# Altium project Ultrascale.PrjPcb (part 5 of 9)

## Sheet PS_GTR.SchDoc
size A3
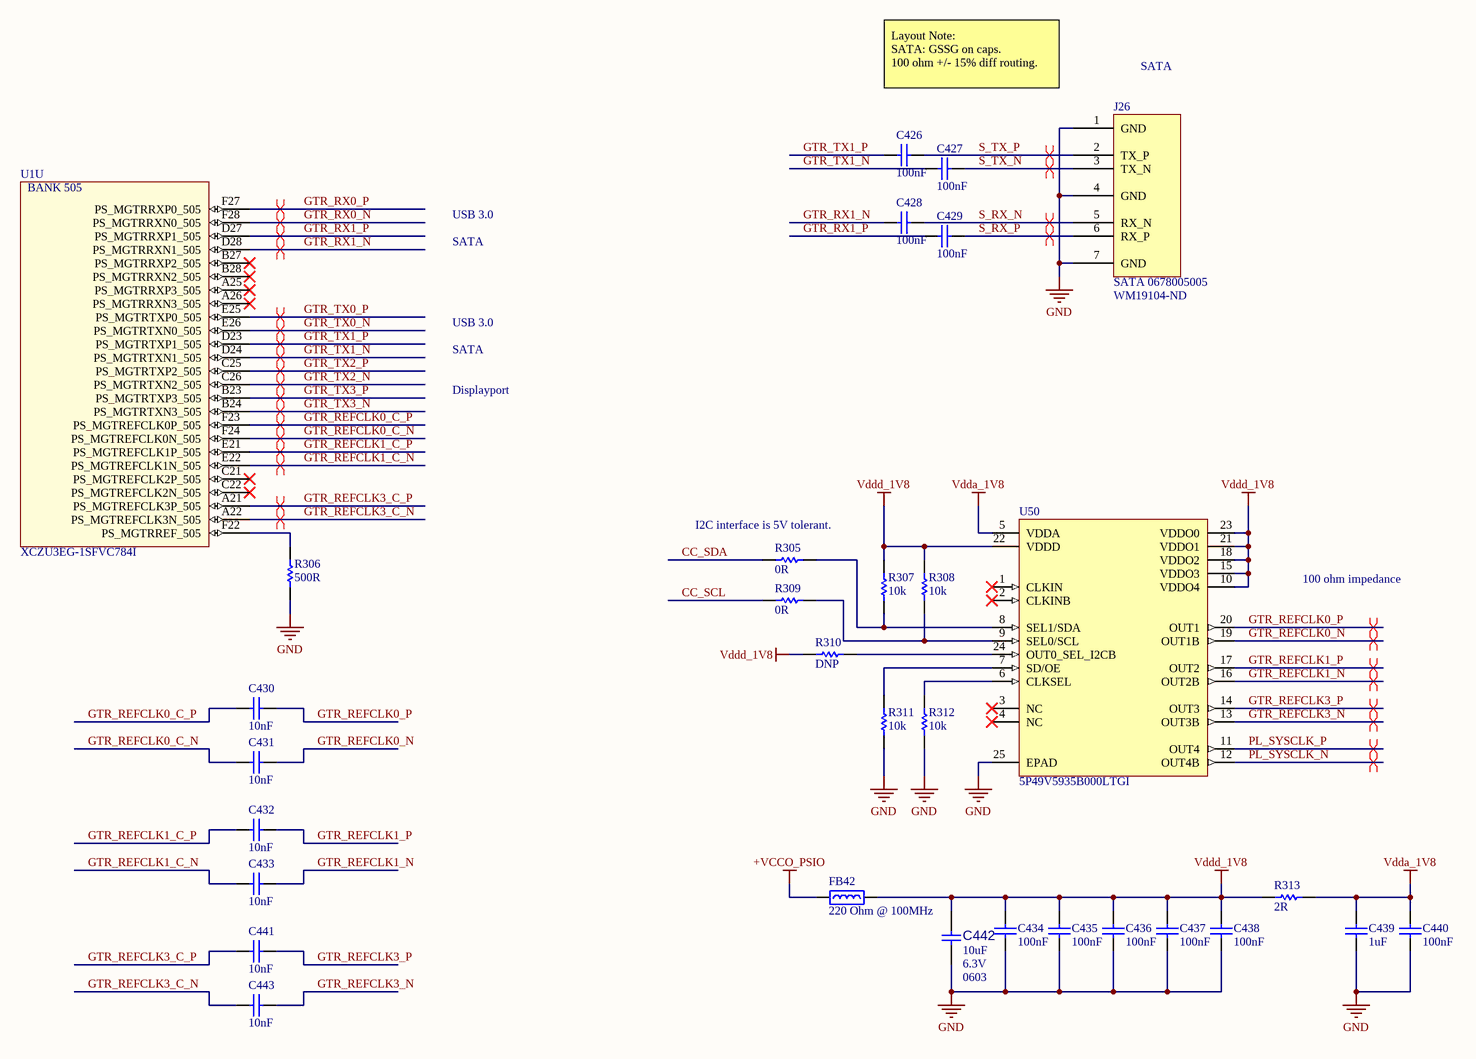
[diagram p13: PS_GTR.SchDoc]

### Parts
C426  100nF  [CAPC1005L_0402]
C427  100nF  [CAPC1005L_0402]
C428  100nF  [CAPC1005L_0402]
C429  100nF  [CAPC1005L_0402]
C430  10nF  [CAPC1005L_0402]
C431  10nF  [CAPC1005L_0402]
C432  10nF  [CAPC1005L_0402]
C433  10nF  [CAPC1005L_0402]
C434  100nF  [CAPC1005L_0402]
C435  100nF  [CAPC1005L_0402]
C436  100nF  [CAPC1005L_0402]
C437  100nF  [CAPC1005L_0402]
C438  100nF  [CAPC1005L_0402]
C439  1uF  [CAPC1005L_0402]
C440  100nF  [CAPC1005L_0402]
C441  10nF  [CAPC1005L_0402]
C442  value 10uF  Voltage: 6.3V  Package: 0603  [CAP_C_0603]  (hidden comment: Capacitor NP)
C443  10nF  [CAPC1005L_0402]
FB42  Impedance @ Frequency: 220 Ohm @ 100MHz  [INDC1608N_0603]  (hidden comment: BEAD0603_220_2A5_40M)
J26  SATA 0678005005  Supplier Part Number 1: WM19104-ND  [SATA HEADER]
R305  value 0R  [RESC1005L_0402]  (hidden comment: RES0402_0R_0W1)
R306  value 500R  [RESC1005L_0402]  (hidden comment: RES0402_500R_0W05_01T)
R307  value 10k  [RESC1005L_0402]  (hidden comment: RES0402_10K_0W1_05T)
R308  value 10k  [RESC1005L_0402]  (hidden comment: RES0402_10K_0W1_05T)
R309  value 0R  [RESC1005L_0402]  (hidden comment: RES0402_0R_0W1)
R310  value DNP  [RESC1005L_0402]  (hidden comment: RES0402)
R311  value 10k  [RESC1005L_0402]  (hidden comment: RES0402_10K_0W1_05T)
R312  value 10k  [RESC1005L_0402]  (hidden comment: RES0402_10K_0W1_05T)
R313  value 2R  [RESC1005L_0402]  (hidden comment: RES0402_2R_0W1_1T)
U1  XCZU3EG-1SFVC784I  [BGA784x28]  (part U of 22)
U50  5P49V5935B000LTGI  [LGA24_5P49V5935B000LTGI]

### Nets
+VCCO_PSIO: FB42.1  [project net +VCCAUX]
GND: C434.1 C435.1 C436.1 C437.1 C438.1 C439.1 C440.1 C442.1 J26.1(GND) J26.4(GND) J26.7(GND) R306.1 R311.1 R312.1 U50.25(EPAD)
Vdda_1V8: C439.2 C440.2 R313.2 U50.5(VDDA)
Vddd_1V8: C434.2 C435.2 C436.2 C437.2 C438.2 C442.2 FB42.2 R307.2 R308.2 R310.1 R313.1 U50.10(VDDO4) U50.15(VDDO3) U50.18(VDDO2) U50.21(VDDO1) U50.22(VDDD) U50.23(VDDO0)
CC_SCL: R309.1
CC_SDA: R305.1
GTR_REFCLK0_C_N: C431.1 U1.F24(PS_MGTREFCLK0N_505)
GTR_REFCLK0_C_P: C430.1 U1.F23(PS_MGTREFCLK0P_505)
GTR_REFCLK0_N: C431.2 U50.19(OUT1B)
GTR_REFCLK0_P: C430.2 U50.20(OUT1)
GTR_REFCLK1_C_N: C433.1 U1.E22(PS_MGTREFCLK1N_505)
GTR_REFCLK1_C_P: C432.1 U1.E21(PS_MGTREFCLK1P_505)
GTR_REFCLK1_N: C433.2 U50.16(OUT2B)
GTR_REFCLK1_P: C432.2 U50.17(OUT2)
GTR_REFCLK3_C_N: C443.1 U1.A22(PS_MGTREFCLK3N_505)
GTR_REFCLK3_C_P: C441.1 U1.A21(PS_MGTREFCLK3P_505)
GTR_REFCLK3_N: C443.2 U50.13(OUT3B)
GTR_REFCLK3_P: C441.2 U50.14(OUT3)
GTR_RX0_N: U1.F28(PS_MGTRRXN0_505)
GTR_RX0_P: U1.F27(PS_MGTRRXP0_505)
GTR_RX1_N: C428.1 U1.D28(PS_MGTRRXN1_505)
GTR_RX1_P: C429.1 U1.D27(PS_MGTRRXP1_505)
GTR_TX0_N: U1.E26(PS_MGTRTXN0_505)
GTR_TX0_P: U1.E25(PS_MGTRTXP0_505)
GTR_TX1_N: C427.1 U1.D24(PS_MGTRTXN1_505)
GTR_TX1_P: C426.1 U1.D23(PS_MGTRTXP1_505)
GTR_TX2_N: U1.C26(PS_MGTRTXN2_505)
GTR_TX2_P: U1.C25(PS_MGTRTXP2_505)
GTR_TX3_N: U1.B24(PS_MGTRTXN3_505)
GTR_TX3_P: U1.B23(PS_MGTRTXP3_505)
PL_SYSCLK_N: U50.12(OUT4B)
PL_SYSCLK_P: U50.11(OUT4)
S_RX_N: C428.2 J26.5(RX_N)
S_RX_P: C429.2 J26.6(RX_P)
S_TX_N: C427.2 J26.3(TX_N)
S_TX_P: C426.2 J26.2(TX_P)
NetR305_2: R305.2 R307.1 U50.8(SEL1/SDA)
NetR306_2: R306.2 U1.F22(PS_MGTRREF_505)
NetR308_1: R308.1 R309.2 U50.9(SEL0/SCL)
NetR310_2: R310.2 U50.24(OUT0_SEL_I2CB)
NetR311_2: R311.2 U50.7(SD/OE)
NetR312_2: R312.2 U50.6(CLKSEL)

Not connected (* = marked no-connect by the designer): U1 A25(PS_MGTRRXP3_505)* A26(PS_MGTRRXN3_505)* B27(PS_MGTRRXP2_505)* B28(PS_MGTRRXN2_505)* C21(PS_MGTREFCLK2P_505)* C22(PS_MGTREFCLK2N_505)*; U50 1(CLKIN)* 2(CLKINB)* 3(NC)* 4(NC)*

### Layout directives
differential pair: GTR_REFCLK0_C_N, GTR_REFCLK0_C_P, GTR_REFCLK0_N, GTR_REFCLK0_P, GTR_REFCLK1_C_N, GTR_REFCLK1_C_P, GTR_REFCLK1_N, GTR_REFCLK1_P, GTR_REFCLK3_C_N, GTR_REFCLK3_C_P, GTR_REFCLK3_N, GTR_REFCLK3_P, GTR_RX0_N, GTR_RX0_P, GTR_RX1_N, GTR_RX1_P, GTR_TX0_N, GTR_TX0_P, GTR_TX1_N, GTR_TX1_P, GTR_TX2_N, GTR_TX2_P, GTR_TX3_N, GTR_TX3_P, PL_SYSCLK_N, PL_SYSCLK_P, S_RX_N, S_RX_P, S_TX_N, S_TX_P

### Notes on the sheet
- Layout Note:
  SATA: GSSG on caps.
  100 ohm +/- 15% diff routing.
- SATA
- USB 3.0
- Displayport
- I2C interface is 5V tolerant.
- 100 ohm impedance
- (in symbol XCZU3EG-1SFVC784I, part U) BANK 505

### Library data of the parts
C426-C429 C434-C438 C440 = CAPCER0402X7R100N25V_10T: CAP CER 0.1UF 25V X7R 0402; Manufacturer 1: Murata Electronics North America; Manufacturer Part Number 1: GRM155R71E104KE14D; Tolerance: 10%; Package: 0402; ComponentLink1Description: Datasheet; Value: 100nF; Voltage: 25V; Temperature Coefficient: X7R; Supplier 1: Digi-Key; Supplier Part Number 1: 490-10698-1-ND; Operating Temperature: -55°C ~ 125°C
C430-C433 C441 C443 = CAPCER0402X7R10N50V_10T: CAP CER 10000PF (10NF) 50V X7R 0402; Manufacturer 1: Murata Electronics North America; Manufacturer Part Number 1: GRM155R71H103KA88D; Tolerance: 10%; Package: 0402; ComponentLink1Description: Datasheet; Value: 10nF; Voltage: 50V; Temperature Coefficient: X7R; Supplier 1: Digi-Key; Supplier Part Number 1: 490-4516-1-ND; Operating Temperature: -55°C ~ 125°C
C439 = CAPCER0402X5R1U16V_20T: CAP CER 1UF 16V X5R 0402; Manufacturer 1: Murata Electronics North America; Manufacturer Part Number 1: GRM155R61C105ME01D; Tolerance: 20%; Package: 0402; ComponentLink1Description: Datasheet; Value: 1uF; Voltage: 16V; Temperature Coefficient: X5R; Supplier 1: Digi-Key; Supplier Part Number 1: 490-10454-1-ND; Operating Temperature: -55°C ~ 85°C
C442 = CAP0533: Capacitor; Manufacturer 1: AVX; Manufacturer Part Number 1: 06036D106MAT2A; Description_: CAP CER 10uF 6.3V 20% X5R SMD 0603; Dev Tools Status: Production; Tolerance: 20%; Temperature Coeffcient: X5R; Type: Ceramic; Populated: Yes; MCHP-ID: CAP0533; Revision: 1; Status: MCL Design; ComponentLink1URL: https://chn-vm-apps.microchip.com/mchprepo/parts/Datasheets/smccp.pdf; ComponentLink1Description: Datasheet; Operating Temperature: -55C to +85C; Category: Capacitor; Manufacturer 2: KEMET; Manufacturer Part Number 2: C0603C106M9PACTU; Manufacturer 3: Murata; Manufacturer Part Number 3: GRM188R60J106ME47D; Manufacturer 4: TDK Corporation; Manufacturer Part Number 4: C1608X5R0J106M080AB; Manufacturer 5: TDK Corporation; Manufacturer Part Number 5: C1608X5R0J106M; Supplier 1: Digi-Key; Supplier Part Number 1: 478-5318-2-ND; Supplier 2: Digi-Key; Supplier Part Number 2: 399-5504-1-ND; Supplier 3: Digi-Key; Supplier Part Number 3: 490-3896-2-ND; Supplier 4: Digi-Key; Supplier Part Number 4: 445-4112-1-ND; Quantity Override: 1
FB42 = BEAD0603_220_2A5_40M: FERRITE BEAD 220 OHM 0603 1LN; Manufacturer 1: Murata Electronics North America; Manufacturer Part Number 1: BLM18SG221TN1D; Current Rating (Max): 2.5A; DC Resistance (DCR) (Max): 40 mohm; Package: 0603; ComponentLink1Description: Datasheet; ComponentLink1URL: C:\Users\Public\Documents\Altium\AD16\Library\PDF\ENFA0003.pdf; Supplier 1: Digi-Key; Supplier Part Number 1: 490-5225-1-ND; Operating Temperature: -55°C ~ 125°C
J26 = SATA 0678005005: CONN HEADER 7POS VERT SMD 15GOLD; Manufacturer: Molex, LLC; Connector Style: Header, Shrouded; Number of Positions: 7; Digi-Key Part Number: WM19104-ND; Manufacturer Part Number: 0678005005; Series: 67800; Part Status: Active; Connector Type: SATA; Mounting Type: Surface Mount; Termination: Solder; Features: Board Guide; Contact Finish: Gold; Contact Finish Thickness: 15µin (0.38µm); Supplier 1: Digi-Key
R305 R309 = RES0402_0R_0W1: RES SMD 0 OHM JUMPER 1/10W 0402; Manufacturer 1: Panasonic Electronic Components; Manufacturer Part Number 1: ERJ-2GE0R00X; Package: 0402; ComponentLink1Description: Datasheet; Power: 1/10W; Tolerance: -; Supplier 1: Digi-Key; Supplier Part Number 1: P0.0JCT-ND
R306 = RES0402_500R_0W05_01T: RES SMD 500 OHM 0.1% 1/20W 0402; Manufacturer 1: Vishay Dale; Manufacturer Part Number 1: PNM0402E5000BST1; Power: 1/10W; Package: 0402; ComponentLink1Description: Datasheet; Tolerance: 0.1%; Supplier 1: Digi-Key; Supplier Part Number 1: 541-1905-1-ND
R307 R308 R311 R312 = RES0402_10K_0W1_05T: RES SMD 10K OHM 0.5% 1/16W 0402; Manufacturer 1: Panasonic Electronic Components; Manufacturer Part Number 1: ERJ-2RHD1002X; Package: 0402; ComponentLink1Description: Datasheet; Power: 1/16W; Tolerance: 0.5%; Supplier 1: Digi-Key; Supplier Part Number 1: P15984CT-ND
R310 = RES0402: RES SMD 0402 Footprint; Package: 0402; ComponentLink1Description: Datasheet; Tolerance: -
R313 = RES0402_2R_0W1_1T: RES SMD 2 OHM 1% 1/16W 0402; Manufacturer 1: Vishay Dale; Manufacturer Part Number 1: CRCW04022R00FKED; Power: 1/10W; Package: 0402; ComponentLink1Description: Datasheet; Tolerance: 1%; Supplier 1: Digi-Key; Supplier Part Number 1: 541-2.00LLCT-ND
U1 = XCZU3EG-1SFVC784I: IC FPGA 252 I/O 784FCBGA - XILINX ZYNQ ULTRASCALE+; Manufacturer 1: Xilinx Inc.; Package: SFVC784; ComponentLink1Description: Datasheet; Supplier 1: Digi-Key; Supplier Part Number 1: XCZU3EG-1SFVC784I-ND; Manufacturer Part Number 1: XCZU3EG-1SFVC784I
U50 = 5P49V5935B000LTGI: IC CLOCK GENERATOR 24LGA; Manufacturer 1: IDT, Integrated Device Technology Inc; ComponentLink1Description: Datasheet; ComponentLink1URL: C:\Users\Public\Documents\Altium\AD16\Library\PDF\IDT_5P49V5935_DST_20171101.pdf; Supplier 1: Digi-Key; Supplier Part Number 1: 800-3409-ND; Manufacturer Part Number 1: 5P49V5935B000LTGI; Operating Temperature: -40°C ~ 85°C

## Sheet DisplayPort.SchDoc
size A3
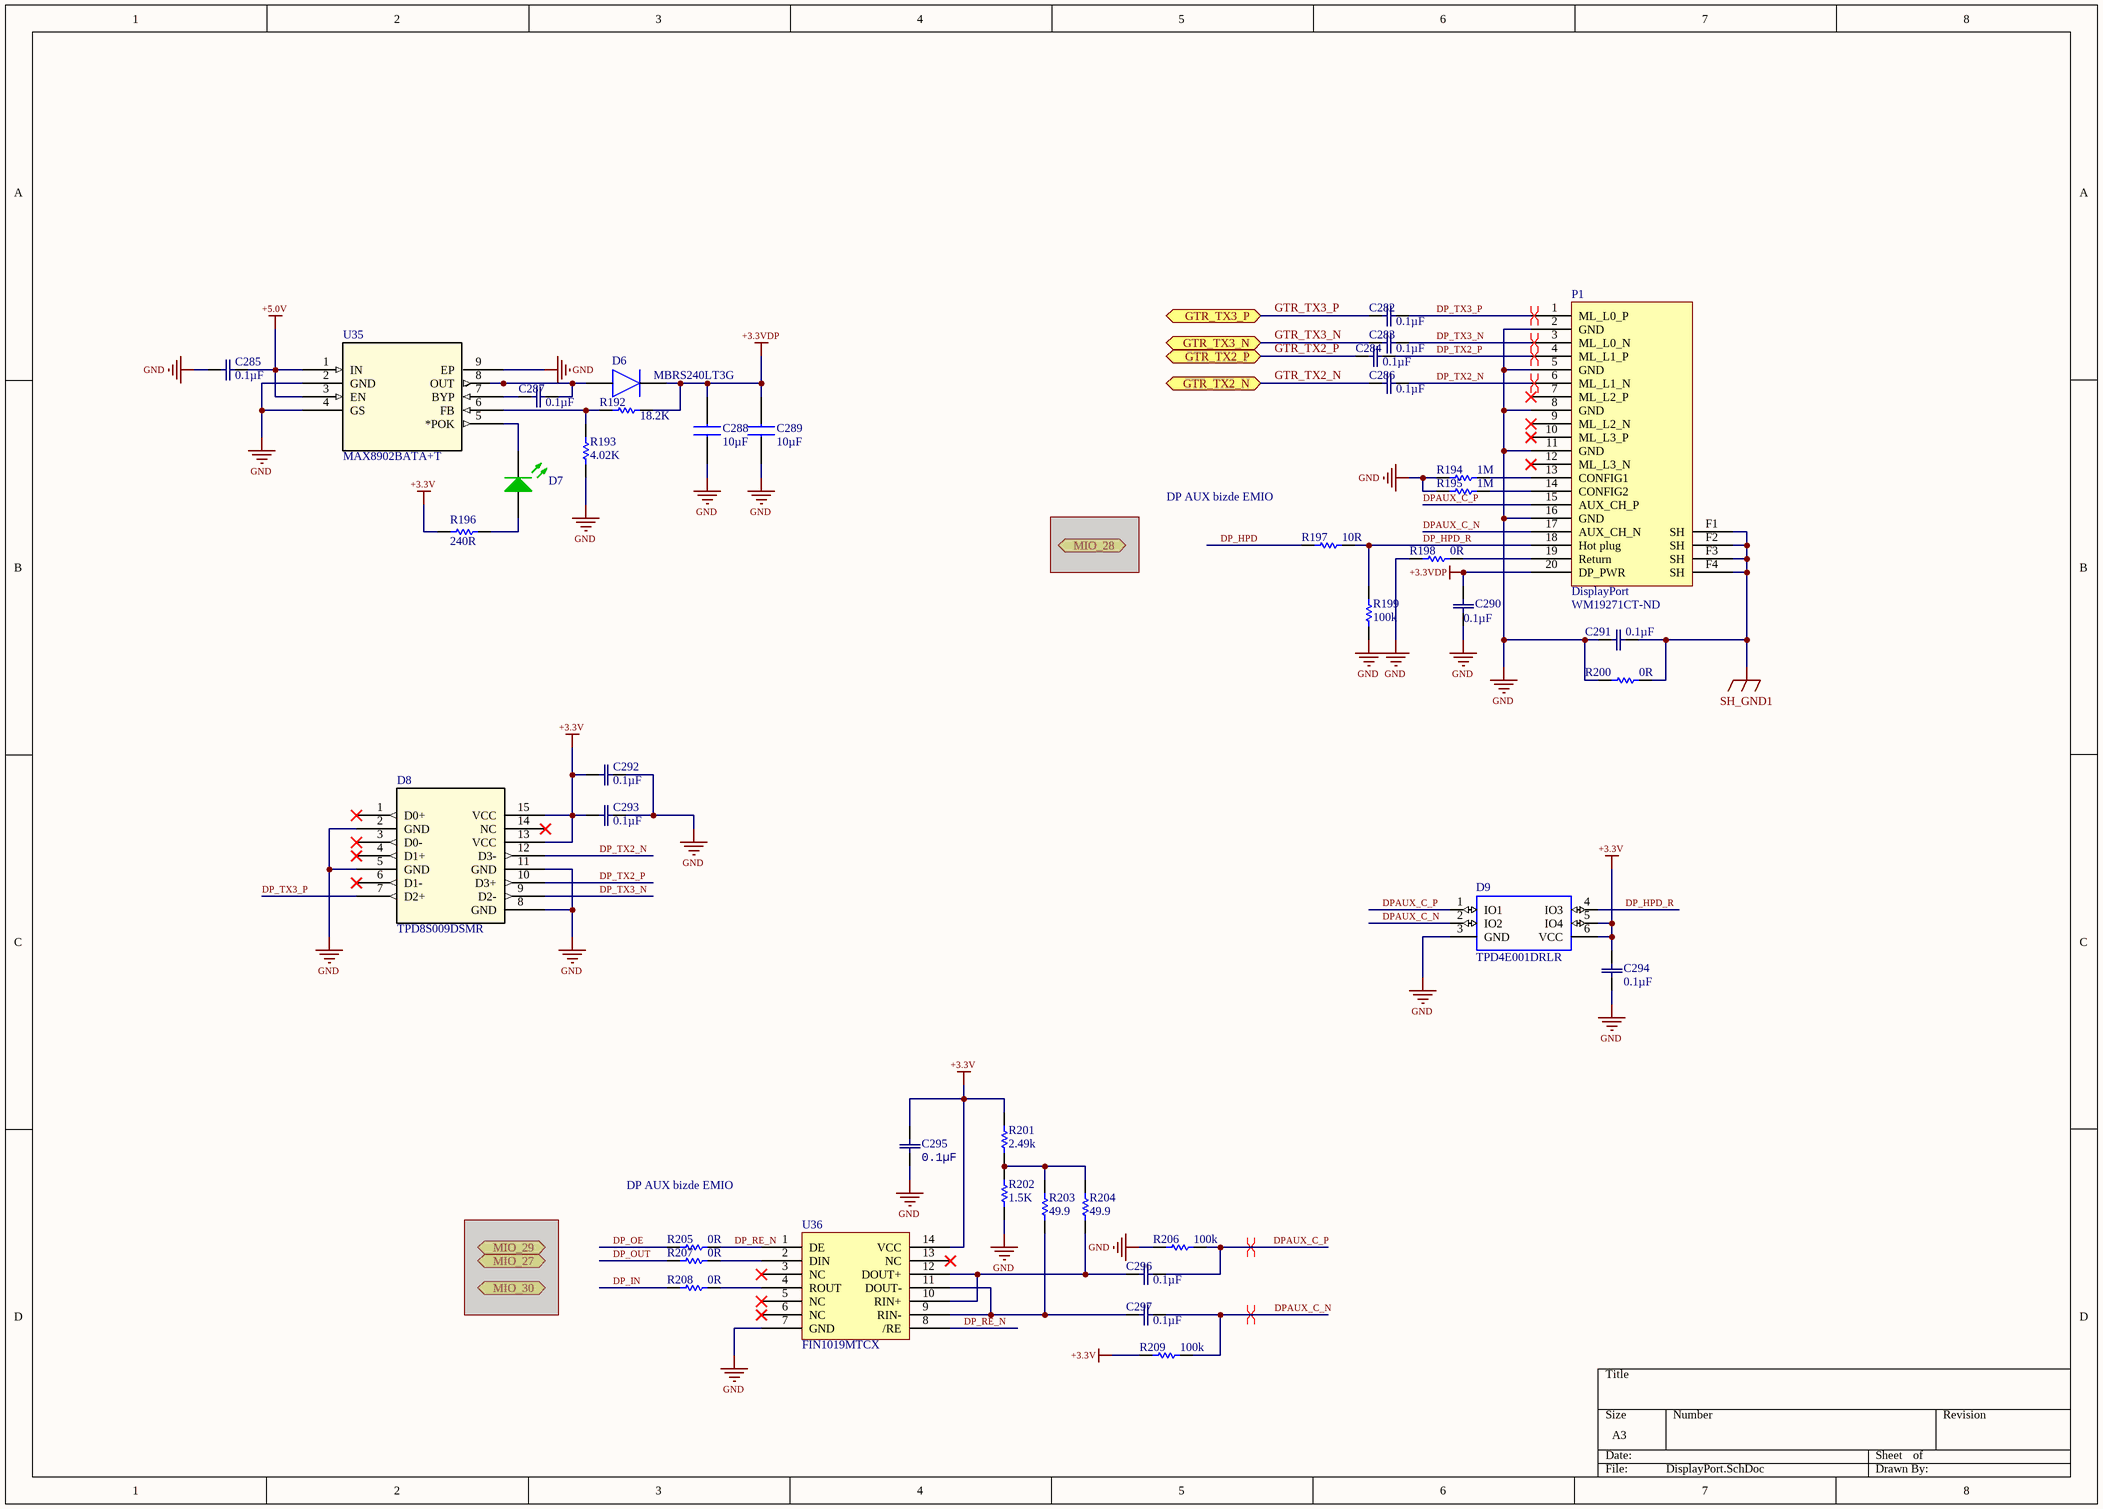
[diagram p14: DisplayPort.SchDoc]

### Parts
C282  value 0.1µF  [CAP_0603]  (hidden comment: C0603X5R1E104K030BB)
C283  value 0.1µF  [CAP_0603]  (hidden comment: C0603X5R1E104K030BB)
C284  value 0.1µF  [CAP_0603]  (hidden comment: C0603X5R1E104K030BB)
C285  value 0.1µF  [CAP_0603]  (hidden comment: C0603X5R1E104K030BB)
C286  value 0.1µF  [CAP_0603]  (hidden comment: C0603X5R1E104K030BB)
C287  value 0.1µF  [CAP_0603]  (hidden comment: C0603X5R1E104K030BB)
C288  value 10µF  [CAP 0402ZD106]  (hidden comment: 0402ZD106MAT2A)
C289  value 10µF  [CAP 0402ZD106]  (hidden comment: 0402ZD106MAT2A)
C290  value 0.1µF  [CAP_0603]  (hidden comment: C0603X5R1E104K030BB)
C291  value 0.1µF  [CAP_0603]  (hidden comment: C0603X5R1E104K030BB)
C292  value 0.1µF  [CAP_0603]  (hidden comment: C0603X5R1E104K030BB)
C293  value 0.1µF  [CAP_0603]  (hidden comment: C0603X5R1E104K030BB)
C294  value 0.1µF  [CAP_0603]  (hidden comment: C0603X5R1E104K030BB)
C295  value 0.1µF  [CAP_0603]  (hidden comment: C0603X5R1E104K030BB)
C296  value 0.1µF  [CAP_0603]  (hidden comment: C0603X5R1E104K030BB)
C297  value 0.1µF  [CAP_0603]  (hidden comment: C0603X5R1E104K030BB)
D6  MBRS240LT3G  [DIOM5436X247N]
D7  LED0603GREEN  [LED0603GREEN]  (value not drawn)
D8  TPD8S009DSMR  [DSM15]
D9  TPD4E001DRLR  [SOTFL50P160X60-6N]
P1  DisplayPort  Supplier Part Number 1: WM19271CT-ND  [8470-2-2-X]
R192  value 18.2K  [RES_CRCW_0402]  (hidden comment: RES0402_18K2)
R193  value 4.02K  [RC0402N]  (hidden comment: RES0402_4K02)
R194  value 1M  [RESC1005L_0402]  (hidden comment: RES0402_1M)
R195  value 1M  [RESC1005L_0402]  (hidden comment: RES0402_1M)
R196  value 240R  [RESC1005L_0402]  (hidden comment: RES0402_240R_0W1_1T)
R197  value 10R  [RESC1005L_0402]  (hidden comment: RES0402_10R)
R198  value 0R  [RESC1005L_0402]  (hidden comment: RES0402_0R)
R199  value 100k  [RESC1005L_0402]  (hidden comment: RES0402_100K_0W2_1T)
R200  value 0R  [RESC1005L_0402]  (hidden comment: RES0402_0R_0W1)
R201  value 2.49k  [RESC1005L_0402]  (hidden comment: RES0402_2K49_0W1_1T)
R202  value 1.5K  [RESC1005L_0402]  (hidden comment: RES0402_1K5)
R203  value 49.9  [RESC1005L_0402]  (hidden comment: RES0402_49.9)
R204  value 49.9  [RESC1005L_0402]  (hidden comment: RES0402_49.9)
R205  value 0R  [RESC1005L_0402]  (hidden comment: RES0402_0R)
R206  value 100k  [RESC1005L_0402]  (hidden comment: RES0402_100K_0W2_1T)
R207  value 0R  [RESC1005L_0402]  (hidden comment: RES0402_0R)
R208  value 0R  [RESC1005L_0402]  (hidden comment: RES0402_0R)
R209  value 100k  [RESC1005L_0402]  (hidden comment: RES0402_100K_0W2_1T)
U35  MAX8902BATA+T  [21-0168E_T822-1]
U36  FIN1019MTCX  [TSOP65P640X120-14N]

### Ports
GTR_TX2_N, GTR_TX2_P, GTR_TX3_N, GTR_TX3_P, MIO_27, MIO_28, MIO_29, MIO_30

### Nets
+3.3V: C292.2 C293.2 C294.2 C295.2 D8.13(VCC) D8.15(VCC) D9.5(IO4) D9.6(VCC) R196.1 R201.2 R209.1 U36.14(VCC)
+3.3VDP: C288.2 C289.2 C290.2 D6.1(K) P1.20(DP_PWR) R192.2
+5.0V: C285.2 U35.1(IN) U35.3(EN)
GND: C285.1 C288.1 C289.1 C290.1 C291.1 C292.1 C293.1 C294.1 C295.1 D8.2(GND) D8.5(GND) D8.8(GND) D8.11(GND) D9.3(GND) P1.2(GND) P1.5(GND) P1.8(GND) P1.11(GND) P1.16(GND) R193.1 R194.1 R195.1 R198.1 R199.1 R200.1 R202.1 R206.1 U35.2(GND) U35.4(GS) U35.9(EP) U36.7(GND)
SH_GND1: C291.2 P1.F1(SH) P1.F2(SH) P1.F3(SH) P1.F4(SH) R200.2
DP_HPD: R197.1
DP_HPD_R: D9.4(IO3) P1.18(Hot_plug) R197.2 R199.2
DP_IN: R208.1
DP_OE: R205.1
DP_OUT: R207.1
DP_RE_N: R205.2 U36.1(DE) U36.8(/RE)
DP_TX2_N: C286.2 D8.12(D3-) P1.6(ML_L1_N)
DP_TX2_P: C284.2 D8.10(D3+) P1.4(ML_L1_P)
DP_TX3_N: C283.2 D8.9(D2-) P1.3(ML_L0_N)
DP_TX3_P: C282.2 D8.7(D2+) P1.1(ML_L0_P)
DPAUX_C_N: C297.2 D9.2(IO2) P1.17(AUX_CH_N) R209.2
DPAUX_C_P: C296.2 D9.1(IO1) P1.15(AUX_CH_P) R206.2
GTR_TX2_N: C286.1 ; port GTR_TX2_N
GTR_TX2_P: C284.1 ; port GTR_TX2_P
GTR_TX3_N: C283.1 ; port GTR_TX3_N
GTR_TX3_P: C282.1 ; port GTR_TX3_P
NetC287_1: C287.1 U35.7(BYP)
NetC287_2: C287.2 D6.2(A) U35.8(OUT)
NetC296_1: C296.1 R204.1 U36.10(RIN+) U36.12(DOUT+)
NetC297_1: C297.1 R203.1 U36.9(RIN-) U36.11(DOUT-)
NetD7_1: D7.1(A) R196.2
NetD7_2: D7.2(K) U35.5(*POK)
NetP1_13: P1.13(CONFIG1) R194.2
NetP1_14: P1.14(CONFIG2) R195.2
NetP1_19: P1.19(Return) R198.2
NetR192_1: R192.1 R193.2 U35.6(FB)
NetR201_1: R201.1 R202.2 R203.2 R204.2
NetR207_2: R207.2 U36.2(DIN)
NetR208_2: R208.2 U36.4(ROUT)

Not connected (* = marked no-connect by the designer): D8 1(D0+)* 3(D0-)* 4(D1+)* 6(D1-)* 14(NC)*; P1 7(ML_L2_P)* 9(ML_L2_N)* 10(ML_L3_P)* 12(ML_L3_N)*; U36 3(NC)* 5(NC)* 6(NC)* 13(NC)*

### Layout directives
differential pair: DP_TX2_N, DP_TX2_P, DP_TX3_N, DP_TX3_P, DPAUX_C_N, DPAUX_C_P

### Notes on the sheet
- DP AUX bizde EMIO

### Library data of the parts
C282-C287 C290-C297 = C0603X5R1E104K030BB: CAP CER 0.1UF 25V 10% X5R 0201; Manufacturer: TDK Corporation; Detailed Description: 0.1µF ±10% 25V Ceramic Capacitor X5R 0201 (0603 Metric); Manufacturer_Part_Number: C0603X5R1E104K030BB; Digi-Key Part Number: 445-13671-1-ND; Tolerance: ±10%; Voltage - Rated: 25V; Temperature Coefficient: X5R; Operating Temperature: -55°C ~ 85°C; Features: Low ESL; Applications: General Purpose; Mounting Type: Surface Mount, MLCC; Supplier 1: Digi-Key; Supplier Part Number 1: 445-13671-1-ND
C288 C289 = CAP 0402ZD106: CAP CER 10UF 10V X5R 0402; Manufacturer_Name: AVX; Geometry.Height: 0.56mm; Detailed Description: 10µF ±20% 10V Ceramic Capacitor X5R 0402 (1005 Metric); Tolerance: ±20%; Manufacturer_Part_Number: 0402ZD106MAT2A; Datasheet Link: http://www.mouser.com/catalog/supplier/library/pdf/AVXSurfaceMountCeramic.pdf; Digi-Key Part Number: 478-10052-1-ND; Voltage - Rated: 10V; Temperature Coefficient: X5R; Operating Temperature: -55°C ~ 85°C; Mounting Type: Surface Mount, MLCC; Supplier 1: Digi-Key; Supplier Part Number 1: 478-10052-2-ND
D6 = D MBRS240LT3G: DIODE SCHOTTKY 40V 2A SMB; Manufacturer_Name: ON Semiconductor; Allied_Number: 70099506; Geometry.Height: 2.47mm; Supplier_Name: RS; RS Part Number: 1022262; Manufacturer_Part_Number: MBRS240LT3G; Other Part Number: *; Datasheet Link: http://www.onsemi.com/pub/Collateral/MBRS240LT3-D.PDF; 3D Package: *; Supplier 1: Digi-Key; Supplier Part Number 1: MBRS240LT3GOSCT-ND
D7 = LED0603GREEN: LED GREEN DIFFUSED 0603 SMD; Manufacturer 1: Broadcom Limited; Manufacturer Part Number 1: HSMM-C190; Voltage - Forward (Vf) (Typ): 3.3V; Current - Test: 20mA; Package: 0603; Supplier 1: Digi-Key; Supplier Part Number 1: 516-2833-1-ND; ComponentLink1Description: Datasheet; ComponentLink1URL: C:\Users\Public\Documents\Altium\AD16\Library\PDF\AV02-0592EN0.pdf
D8 = TPD8S009DSMR: TVS DIODE 5.5VWM 15SON; Vendor: Texas Instruments; Section: Power Management; C: Copyright (C) 2015 Accelerated Designs. All rights reserved; Manufacturer_Part_Number: TPD8S009DSMR; Family: Power Misc; Manufacturer_Name: Texas Instruments; Copyright: Copyright (C) 2015 Accelerated Designs. All rights reserved; RS_Part_Number: 7099082; Value: Value; Type: Type; RefDes: RefDes; Supplier 1: Digi-Key; Supplier Part Number 1: 296-23829-1-ND
D9 = D TPD4E001DRLR: Low-Capacitance 4-Channel +/-15-kV ESD Protection Array for High-Speed Data Interfaces; Manufacturer_Name: Texas Instruments; Geometry.Height: 0.6mm; Type: Steering; Unidirectional Channels: 4; Voltage - Reverse Standoff (Typ): 5.5V (Max); Voltage - Breakdown (Min): 11V; Power - Peak Pulse: 100W; Power Line Protection: Yes; Manufacturer_Part_Number: TPD4E001DRLR; Datasheet Link: http://www.ti.com/lit/ds/symlink/tpd4e001.pdf; Digi-Key Part Number: 296-21887-1-ND; Applications: Ethernet; Operating Temperature: -40°C ~ 85°C (TA); Mounting Type: Surface Mount; Package / Case: SOT-563, SOT-666; Supplier Device Package: 6-SOT; Supplier 1: Digi-Key; Supplier Part Number 1: 296-21887-1-ND
P1 = DisplayPort: CONN RCPT 20POS UDI R/A SMD; Manufacturer: Molex, LLC; Manufacturer Part Number: 0472720001; Detailed Description: DisplayPort Receptacle Connector 20 Position Surface Mount, Right Angle; Through Hole; Number of Contacts: 20; Gender: Receptacle; Number of Ports: 1; Current Rating: 0.5A; Voltage - Rated: 40VAC; Mating Cycles: 10000; Shielding: Shielded; Material Flammability Rating: UL94 V-0; Digi-Key Part Number: WM19271CT-ND; Series: 47272; Connector Type: DisplayPort; Specifications: -; Mounting Type: Surface Mount, Right Angle; Through Hole; Mounting Feature: Horizontal; Termination: Solder; Features: Board Guide, Latch Lock; Ingress Protection: -; Operating Temperature: -20°C ~ 85°C; Contact Finish: Gold; Shell/Shielding Material: Steel, Stainless; Insulation Color: Black; Supplier 1: Digi-Key
R192 = RES0402_18K2: RES SMD 18.2K OHM 1% 1/16W 0402; Manufacturer_Part_Number: CRCW040218K2FKED; Vendor: Vishay; Supersection: Passives; Section: Resistors; C: Copyright (C) 2015 Accelerated Designs. All rights reserved; Family: Surface Mount, Fixed; Manufacturer_Name: Vishay; Copyright: Copyright (C) 2015 Accelerated Designs. All rights reserved; RS_Part_Number: 6784684; Supplier 1: Digi-Key
R193 = RES0402_4K02: RES SMD 4.02K OHM 1% 1/16W 0402; Manufacturer_Part_Number: CRCW04024K02FKED; Vendor: Vishay; Resistance_In_Ohms: 0.0; Power_(Watts): 0.063W, 1/16W; Tolerance: Jumper; Lead_Style: Surface Mount (SMD - SMT); Voltage_-_Working: 50V; Number_of_Terminations: 2; C: Copyright (C) 2015 Accelerated Designs. All rights reserved; DigiKeyPartNumber: 541-0.0JTR-ND; Quantity_Available: 3480000; Copyright: Copyright (C) 2015 Accelerated Designs. All rights reserved; DataSheet: http://www.vishay.com/docs/20035/dcrcwe3.pdf; Case: 0402 (1005 metric); Packaging: Tape &amp; Reel (TR); Composition: Thick Film; Temperature_Coefficient: -; Resistance_(Ohms): 0.0; Features: -; Package_/_Case: 0402 (1005 Metric); Size_/_Dimension: 0.039" L x 0.020" W (1.00mm x 0.50mm); Height: 0.016" (0.40mm)
R194 R195 = RES0402_1M: RES SMD 1M OHM 1% 1/16W 0402; Manufacturer: Vishay Dale; Manufacturer Part Number: CRCW04021M00FKED; Power: 0.063W, 1/16W; Package: 0402; ComponentLink1Description: Datasheet; Tolerance: 1%; Supplier 1: Digi-Key; Supplier Part Number 1: 311-1.00MLRCT-ND
R196 = RES0402_240R_0W1_1T: RES SMD 240 OHM 1% 1/10W 0402; Manufacturer 1: Panasonic Electronic Components; Manufacturer Part Number 1: ERJ-2RKF2400X; Package: 0402; ComponentLink1Description: Datasheet; Power: 1/10W; Tolerance: 1%; Supplier 1: Digi-Key; Supplier Part Number 1: P240LCT-ND
R197 = RES0402_10R: RES SMD 10 OHM 1% 1/16W 0402; Manufacturer 1: Vishay Dale; Manufacturer Part Number 1: CRCW040210R0FKED; Power: 0.063W, 1/16W; Package: 0402; ComponentLink1Description: Datasheet; Tolerance: -; Supplier 1: Digi-Key; Supplier Part Number 1: 541-10.0YCT-ND
R198 R205 R207 R208 = RES0402_0R: RES SMD 0 OHM JUMPER 1/16W 0402; Manufacturer 1: Vishay Dale; Manufacturer Part Number 1: CRCW04020000Z0ED; Power: 0.063W, 1/16W; Package: 0402; ComponentLink1Description: Datasheet; Tolerance: -; Supplier 1: Digi-Key; Supplier Part Number 1: 541-0.0JCT-ND
R199 R206 R209 = RES0402_100K_0W2_1T: RES SMD 100K OHM 1% 1/5W 0402; Manufacturer 1: Vishay Dale; Manufacturer Part Number 1: RCS0402100KFKED; Package: 0402; ComponentLink1Description: Datasheet; Power: 1/5W; Tolerance: 1%; Supplier 1: Digi-Key; Supplier Part Number 1: 541-2899-1-ND
R200 = RES0402_0R_0W1: as R305 on sheet PS_GTR; Package: 0402; ComponentLink1Description: Datasheet; Power: 1/10W; Tolerance: -; Supplier 1: Digi-Key; Supplier Part Number 1: P0.0JCT-ND
R201 = RES0402_2K49_0W1_1T: RES SMD 2.49K OHM 1% 1/10W 0402; Manufacturer 1: Panasonic Electronic Components; Manufacturer Part Number 1: ERJ-2RKF2491X; Package: 0402; ComponentLink1Description: Datasheet; Power: 1/10W; Tolerance: 1%; Supplier 1: Digi-Key; Supplier Part Number 1: P2.49KLCT-ND
R202 = RES0402_1K5: RES SMD 1.5K OHM 1% 1/16W 0402; Manufacturer 1: Vishay Dale; Manufacturer Part Number 1: CRCW04021K50FKED; Power: 1/10W; Package: 0402; ComponentLink1Description: Datasheet; Tolerance: 1%; Supplier 1: Digi-Key
R203 R204 = RES0402_49.9: RES SMD 49.9 OHM 1% 1/16W 0402; Manufacturer: Vishay Dale; Manufacturer Part Number: CRCW040249R9FKED; Power: 0.063W, 1/16W; Package: 0402; ComponentLink1Description: Datasheet; Tolerance: 1%; Supplier 1: Digi-Key; Supplier Part Number 1: 311-49.9LRCT-ND
U35 = MAX8902BATA+T: IC REG LDO ADJ 0.5A 8TDFN; Vendor: Maxim Integrated Products; C: Copyright (C) 2015 Accelerated Designs. All rights reserved; Manufacturer_Part_Number: MAX8902BATA+T; Copyright: Copyright (C) 2015 Accelerated Designs. All rights reserved; Value: Value; Type: Type; RefDes: RefDes; Supplier 1: Digi-Key; Supplier Part Number 1: MAX8902BATA+TCT-ND
U36 = FIN1019MTCX: IC DRVR/RCVR3.3V LVDS HS 14TSSOP; Manufacturer: Fairchild/ON Semiconductor; Detailed Description: 1/1 Transceiver Full LVDS 14-TSSOP; Number of Drivers/Receivers: 1/1; Duplex: Full; Voltage - Supply: 3 V ~ 3.6 V; Data Rate: 400Mbps; Digi-Key Part Number: FIN1019MTCXCT-ND; Manufacturer Part Number: FIN1019MTCX; Type: Transceiver; Protocol: LVDS; Supplier Device Package: 14-TSSOP; Mounting Type: Surface Mount; Package / Case: 14-TSSOP (0.173", 4.40mm Width); Supplier 1: Digi-Key; Supplier Part Number 1: FIN1019MTCXCT-ND

## Sheet PL_IO.SchDoc
size A3
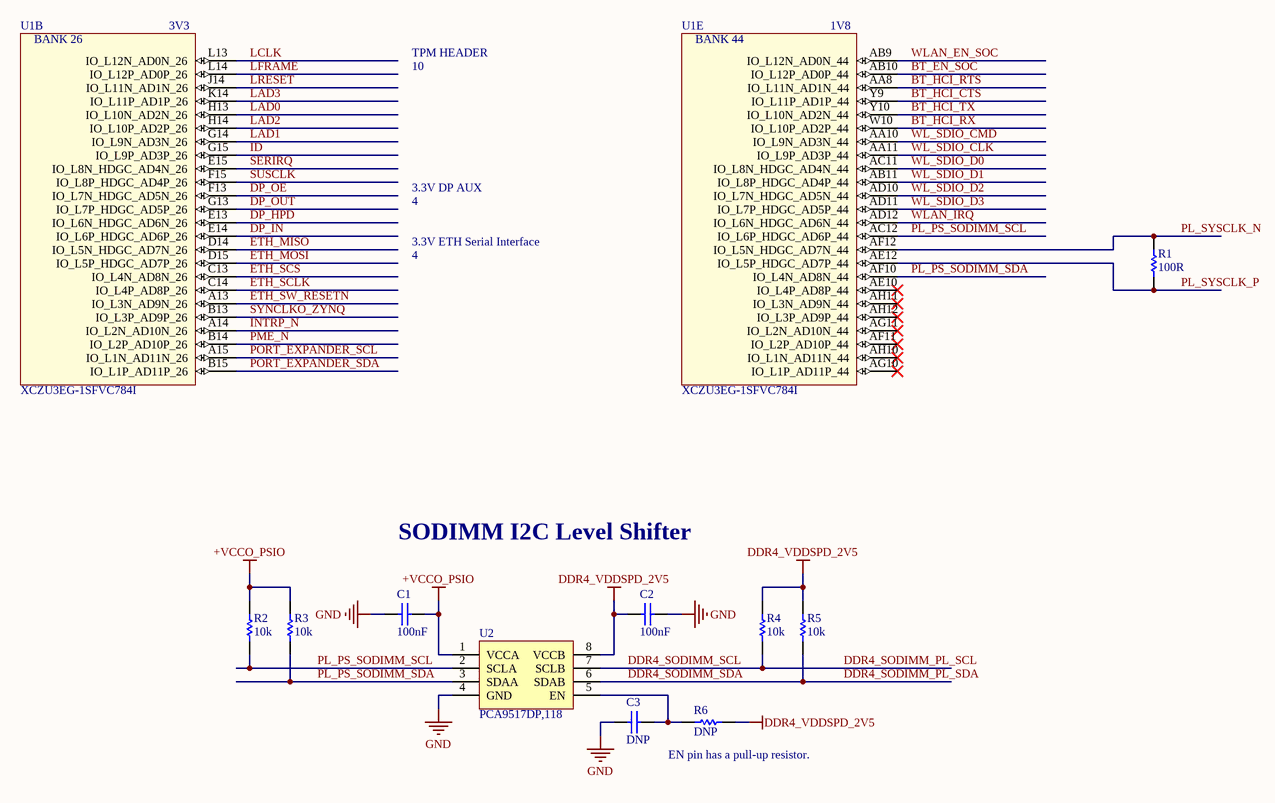
[diagram p15: PL_IO.SchDoc]

### Parts
C1  100nF  [CAPC1005L_0402]
C2  100nF  [CAPC1005L_0402]
C3  DNP  [CAPC1005L_0402]
R1  value 100R  [RESC1005L_0402]  (hidden comment: RES0402_100R_0W1_1T)
R2  value 10k  [RESC1005L_0402]  (hidden comment: RES0402_10K_0W1_05T)
R3  value 10k  [RESC1005L_0402]  (hidden comment: RES0402_10K_0W1_05T)
R4  value 10k  [RESC1005L_0402]  (hidden comment: RES0402_10K_0W1_05T)
R5  value 10k  [RESC1005L_0402]  (hidden comment: RES0402_10K_0W1_05T)
R6  value DNP  [RESC1005L_0402]  (hidden comment: RES0402)
U1  XCZU3EG-1SFVC784I  [BGA784x28]  (parts B,E of 22)
U2  PCA9517DP,118  [MSOP8_PCA9517DP,118]

### Nets
+VCCO_PSIO: C1.2 R2.2 R3.2 U2.1(VCCA)  [project net +VCCAUX]
DDR4_VDDSPD_2V5: C2.1 R4.2 R5.2 R6.2 U2.8(VCCB)
GND: C1.1 C2.2 C3.1 U2.4(GND)
BT_EN_SOC: U1.AB10(IO_L12P_AD0P_44)
BT_HCI_CTS: U1.Y9(IO_L11P_AD1P_44)
BT_HCI_RTS: U1.AA8(IO_L11N_AD1N_44)
BT_HCI_RX: U1.W10(IO_L10P_AD2P_44)
BT_HCI_TX: U1.Y10(IO_L10N_AD2N_44)
DDR4_SODIMM_PL_SCL: R4.1 U2.7(SCLB)  [also labelled DDR4_SODIMM_SCL]
DDR4_SODIMM_PL_SDA: R5.1 U2.6(SDAB)  [also labelled DDR4_SODIMM_SDA]
DP_HPD: U1.E13(IO_L6N_HDGC_AD6N_26)
DP_IN: U1.E14(IO_L6P_HDGC_AD6P_26)
DP_OE: U1.F13(IO_L7N_HDGC_AD5N_26)
DP_OUT: U1.G13(IO_L7P_HDGC_AD5P_26)
ETH_MISO: U1.D14(IO_L5N_HDGC_AD7N_26)
ETH_MOSI: U1.D15(IO_L5P_HDGC_AD7P_26)
ETH_SCLK: U1.C14(IO_L4P_AD8P_26)
ETH_SCS: U1.C13(IO_L4N_AD8N_26)
ETH_SW_RESETN: U1.A13(IO_L3N_AD9N_26)
ID: U1.G15(IO_L9P_AD3P_26)
INTRP_N: U1.A14(IO_L2N_AD10N_26)
LAD0: U1.H13(IO_L10N_AD2N_26)
LAD1: U1.G14(IO_L9N_AD3N_26)
LAD2: U1.H14(IO_L10P_AD2P_26)
LAD3: U1.K14(IO_L11P_AD1P_26)
LCLK: U1.L13(IO_L12N_AD0N_26)
LFRAME: U1.L14(IO_L12P_AD0P_26)
LRESET: U1.J14(IO_L11N_AD1N_26)
PL_PS_SODIMM_SCL: R2.1 U1.AC12(IO_L6P_HDGC_AD6P_44) U2.2(SCLA)
PL_PS_SODIMM_SDA: R3.1 U1.AF10(IO_L4N_AD8N_44) U2.3(SDAA)
PL_SYSCLK_N: R1.2 U1.AF12(IO_L5N_HDGC_AD7N_44)
PL_SYSCLK_P: R1.1 U1.AE12(IO_L5P_HDGC_AD7P_44)
PME_N: U1.B14(IO_L2P_AD10P_26)
PORT_EXPANDER_SCL: U1.A15(IO_L1N_AD11N_26)
PORT_EXPANDER_SDA: U1.B15(IO_L1P_AD11P_26)
SERIRQ: U1.E15(IO_L8N_HDGC_AD4N_26)
SUSCLK: U1.F15(IO_L8P_HDGC_AD4P_26)
SYNCLKO_ZYNQ: U1.B13(IO_L3P_AD9P_26)
WL_SDIO_CLK: U1.AA11(IO_L9P_AD3P_44)
WL_SDIO_CMD: U1.AA10(IO_L9N_AD3N_44)
WL_SDIO_D0: U1.AC11(IO_L8N_HDGC_AD4N_44)
WL_SDIO_D1: U1.AB11(IO_L8P_HDGC_AD4P_44)
WL_SDIO_D2: U1.AD10(IO_L7N_HDGC_AD5N_44)
WL_SDIO_D3: U1.AD11(IO_L7P_HDGC_AD5P_44)
WLAN_EN_SOC: U1.AB9(IO_L12N_AD0N_44)
WLAN_IRQ: U1.AD12(IO_L6N_HDGC_AD6N_44)
NetC3_2: C3.2 R6.1 U2.5(EN)

Not connected (* = marked no-connect by the designer): U1 AE10(IO_L4P_AD8P_44)* AF11(IO_L2P_AD10P_44)* AG10(IO_L1P_AD11P_44)* AG11(IO_L2N_AD10N_44)* AH10(IO_L1N_AD11N_44)* AH11(IO_L3N_AD9N_44)* AH12(IO_L3P_AD9P_44)*

### Notes on the sheet
- (near U1) 3V3
- (near U1) 1V8
- TPM HEADER
- 10
- 3.3V DP AUX
- 4
- 3.3V ETH Serial Interface
- SODIMM I2C Level Shifter
- EN pin has a pull-up resistor.
- (in symbol XCZU3EG-1SFVC784I, part B) BANK 26
- (in symbol XCZU3EG-1SFVC784I, part E) BANK 44

### Library data of the parts
C1 C2 = CAPCER0402X7R100N25V_10T: as C426-C429 on sheet PS_GTR; Package: 0402; ComponentLink1Description: Datasheet; Value: 100nF; Voltage: 25V; Temperature Coefficient: X7R; Supplier 1: Digi-Key; Supplier Part Number 1: 490-10698-1-ND; Operating Temperature: -55°C ~ 125°C
C3 = CAPCER0402: 0402 Package Cap Footprint; Package: 0402; ComponentLink1Description: Datasheet; Value: DNP
R1 = RES0402_100R_0W1_1T: RES SMD 100 OHM 1% 1/10W 0402; Manufacturer 1: Panasonic Electronic Components; Manufacturer Part Number 1: ERJ-2RKF1000X; Package: 0402; ComponentLink1Description: Datasheet; Power: 1/10W; Tolerance: 1%; Supplier 1: Digi-Key; Supplier Part Number 1: P100LCT-ND
R2-R5 = RES0402_10K_0W1_05T: as R307 on sheet PS_GTR; Package: 0402; ComponentLink1Description: Datasheet; Power: 1/16W; Tolerance: 0.5%; Supplier 1: Digi-Key; Supplier Part Number 1: P15984CT-ND
R6 = RES0402: RES SMD 0402 Footprint; Package: 0402; ComponentLink1Description: Datasheet; Tolerance: -
U1 = XCZU3EG-1SFVC784I: as U1 on sheet PS_GTR; Package: SFVC784; ComponentLink1Description: Datasheet; Supplier 1: Digi-Key; Supplier Part Number 1: XCZU3EG-1SFVC784I-ND; Manufacturer Part Number 1: XCZU3EG-1SFVC784I
U2 = PCA9517DP,118: IC REDRIVER I2C 1CH 8TSSOP; Manufacturer 1: NXP USA Inc.; ComponentLink1Description: Datasheet; ComponentLink1URL: C:\Users\Public\Documents\Altium\AD16\Library\PDF\PCA9517.pdf; Supplier 1: Digi-Key; Supplier Part Number 1: 568-1829-1-ND; Manufacturer Part Number 1: PCA9517DP,118; Operating Temperature: -40°C ~ 85°C

## Sheet PS_MIO.SchDoc
size A3
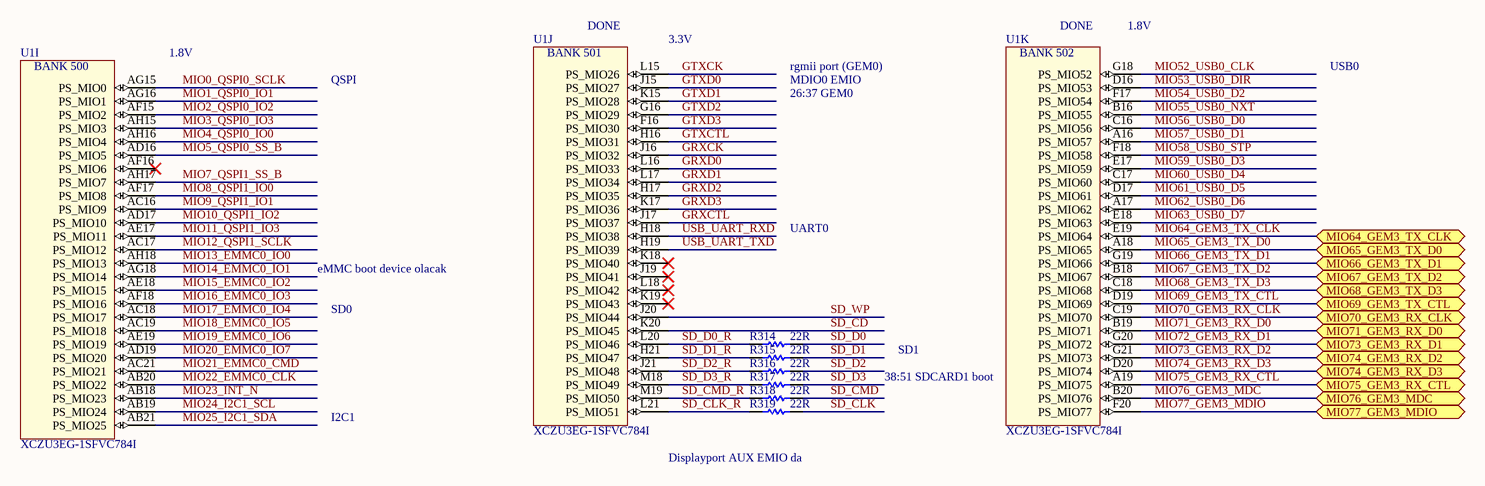
[diagram p16: PS_MIO.SchDoc]

### Parts
R314  value 22R  [RESC1005L_0402]  (hidden comment: RES0402_22R_0W1_1T)
R315  value 22R  [RESC1005L_0402]  (hidden comment: RES0402_22R_0W1_1T)
R316  value 22R  [RESC1005L_0402]  (hidden comment: RES0402_22R_0W1_1T)
R317  value 22R  [RESC1005L_0402]  (hidden comment: RES0402_22R_0W1_1T)
R318  value 22R  [RESC1005L_0402]  (hidden comment: RES0402_22R_0W1_1T)
R319  value 22R  [RESC1005L_0402]  (hidden comment: RES0402_22R_0W1_1T)
U1  XCZU3EG-1SFVC784I  [BGA784x28]  (parts I,J,K of 22)

### Ports
MIO64_GEM3_TX_CLK, MIO65_GEM3_TX_D0, MIO66_GEM3_TX_D1, MIO67_GEM3_TX_D2, MIO68_GEM3_TX_D3, MIO69_GEM3_TX_CTL, MIO70_GEM3_RX_CLK, MIO71_GEM3_RX_D0, MIO73_GEM3_RX_D1, MIO74_GEM3_RX_D2, MIO74_GEM3_RX_D3, MIO75_GEM3_RX_CTL, MIO76_GEM3_MDC, MIO77_GEM3_MDIO

### Nets
GRXCK: U1.J16(PS_MIO32)
GRXCTL: U1.J17(PS_MIO37)
GRXD0: U1.L16(PS_MIO33)
GRXD1: U1.L17(PS_MIO34)
GRXD2: U1.H17(PS_MIO35)
GRXD3: U1.K17(PS_MIO36)
GTXCK: U1.L15(PS_MIO26)
GTXCTL: U1.H16(PS_MIO31)
GTXD0: U1.J15(PS_MIO27)
GTXD1: U1.K15(PS_MIO28)
GTXD2: U1.G16(PS_MIO29)
GTXD3: U1.F16(PS_MIO30)
MIO0_QSPI0_SCLK: U1.AG15(PS_MIO0)
MIO1_QSPI0_IO1: U1.AG16(PS_MIO1)
MIO2_QSPI0_IO2: U1.AF15(PS_MIO2)
MIO3_QSPI0_IO3: U1.AH15(PS_MIO3)
MIO4_QSPI0_IO0: U1.AH16(PS_MIO4)
MIO5_QSPI0_SS_B: U1.AD16(PS_MIO5)
MIO7_QSPI1_SS_B: U1.AH17(PS_MIO7)
MIO8_QSPI1_IO0: U1.AF17(PS_MIO8)
MIO9_QSPI1_IO1: U1.AC16(PS_MIO9)
MIO10_QSPI1_IO2: U1.AD17(PS_MIO10)
MIO11_QSPI1_IO3: U1.AE17(PS_MIO11)
MIO12_QSPI1_SCLK: U1.AC17(PS_MIO12)
MIO13_EMMC0_IO0: U1.AH18(PS_MIO13)
MIO14_EMMC0_IO1: U1.AG18(PS_MIO14)
MIO15_EMMC0_IO2: U1.AE18(PS_MIO15)
MIO16_EMMC0_IO3: U1.AF18(PS_MIO16)
MIO17_EMMC0_IO4: U1.AC18(PS_MIO17)
MIO18_EMMC0_IO5: U1.AC19(PS_MIO18)
MIO19_EMMC0_IO6: U1.AE19(PS_MIO19)
MIO20_EMMC0_IO7: U1.AD19(PS_MIO20)
MIO21_EMMC0_CMD: U1.AC21(PS_MIO21)
MIO22_EMMC0_CLK: U1.AB20(PS_MIO22)
MIO23_INT_N: U1.AB18(PS_MIO23)
MIO24_I2C1_SCL: U1.AB19(PS_MIO24)
MIO25_I2C1_SDA: U1.AB21(PS_MIO25)
MIO52_USB0_CLK: U1.G18(PS_MIO52)
MIO53_USB0_DIR: U1.D16(PS_MIO53)
MIO54_USB0_D2: U1.F17(PS_MIO54)
MIO55_USB0_NXT: U1.B16(PS_MIO55)
MIO56_USB0_D0: U1.C16(PS_MIO56)
MIO57_USB0_D1: U1.A16(PS_MIO57)
MIO58_USB0_STP: U1.F18(PS_MIO58)
MIO59_USB0_D3: U1.E17(PS_MIO59)
MIO60_USB0_D4: U1.C17(PS_MIO60)
MIO61_USB0_D5: U1.D17(PS_MIO61)
MIO62_USB0_D6: U1.A17(PS_MIO62)
MIO63_USB0_D7: U1.E18(PS_MIO63)
MIO64_GEM3_TX_CLK: U1.E19(PS_MIO64) ; port MIO64_GEM3_TX_CLK
MIO65_GEM3_TX_D0: U1.A18(PS_MIO65) ; port MIO65_GEM3_TX_D0
MIO66_GEM3_TX_D1: U1.G19(PS_MIO66) ; port MIO66_GEM3_TX_D1
MIO67_GEM3_TX_D2: U1.B18(PS_MIO67) ; port MIO67_GEM3_TX_D2
MIO68_GEM3_TX_D3: U1.C18(PS_MIO68) ; port MIO68_GEM3_TX_D3
MIO69_GEM3_TX_CTL: U1.D19(PS_MIO69) ; port MIO69_GEM3_TX_CTL
MIO70_GEM3_RX_CLK: U1.C19(PS_MIO70) ; port MIO70_GEM3_RX_CLK
MIO71_GEM3_RX_D0: U1.B19(PS_MIO71) ; port MIO71_GEM3_RX_D0
MIO72_GEM3_RX_D1: U1.G20(PS_MIO72) ; port MIO73_GEM3_RX_D1
MIO73_GEM3_RX_D2: U1.G21(PS_MIO73) ; port MIO74_GEM3_RX_D2
MIO74_GEM3_RX_D3: U1.D20(PS_MIO74) ; port MIO74_GEM3_RX_D3
MIO75_GEM3_RX_CTL: U1.A19(PS_MIO75) ; port MIO75_GEM3_RX_CTL
MIO76_GEM3_MDC: U1.B20(PS_MIO76) ; port MIO76_GEM3_MDC
MIO77_GEM3_MDIO: U1.F20(PS_MIO77) ; port MIO77_GEM3_MDIO
SD_CD: U1.K20(PS_MIO45)
SD_CLK: R319.2
SD_CLK_R: R319.1 U1.L21(PS_MIO51)
SD_CMD: R318.2
SD_CMD_R: R318.1 U1.M19(PS_MIO50)
SD_D0: R314.2
SD_D0_R: R314.1 U1.L20(PS_MIO46)
SD_D1: R315.2
SD_D1_R: R315.1 U1.H21(PS_MIO47)
SD_D2: R316.2
SD_D2_R: R316.1 U1.J21(PS_MIO48)
SD_D3: R317.2
SD_D3_R: R317.1 U1.M18(PS_MIO49)
SD_WP: U1.J20(PS_MIO44)
USB_UART_RXD: U1.H18(PS_MIO38)
USB_UART_TXD: U1.H19(PS_MIO39)

Not connected (* = marked no-connect by the designer): U1 AF16(PS_MIO6)* J19(PS_MIO41)* K18(PS_MIO40)* K19(PS_MIO43)* L18(PS_MIO42)*

### Notes on the sheet
- 1.8V
- (near U1) DONE
- (near U1) 3.3V
- (near U1) 1.8V
- QSPI
- rgmii port (GEM0)
- 26:37 GEM0
- MDIO0 EMIO
- USB0
- UART0
- eMMC boot device olacak
- SD0
- 38:51 SDCARD1 boot
- SD1
- I2C1
- Displayport AUX EMIO da
- (in symbol XCZU3EG-1SFVC784I, part I) BANK 500
- (in symbol XCZU3EG-1SFVC784I, part J) BANK 501
- (in symbol XCZU3EG-1SFVC784I, part K) BANK 502

### Library data of the parts
R314-R319 = RES0402_22R_0W1_1T: RES SMD 22 OHM 1% 1/10W 0402; Manufacturer 1: Panasonic Electronic Components; Manufacturer Part Number 1: ERJ-2RKF22R0X; Package: 0402; ComponentLink1Description: Datasheet; Power: 1/10W; Tolerance: 1%; Supplier 1: Digi-Key; Supplier Part Number 1: P22.0LCT-ND
U1 = XCZU3EG-1SFVC784I: as U1 on sheet PS_GTR; Package: SFVC784; ComponentLink1Description: Datasheet; Supplier 1: Digi-Key; Supplier Part Number 1: XCZU3EG-1SFVC784I-ND; Manufacturer Part Number 1: XCZU3EG-1SFVC784I

## Sheet USB3.0_UART.SchDoc
size A3
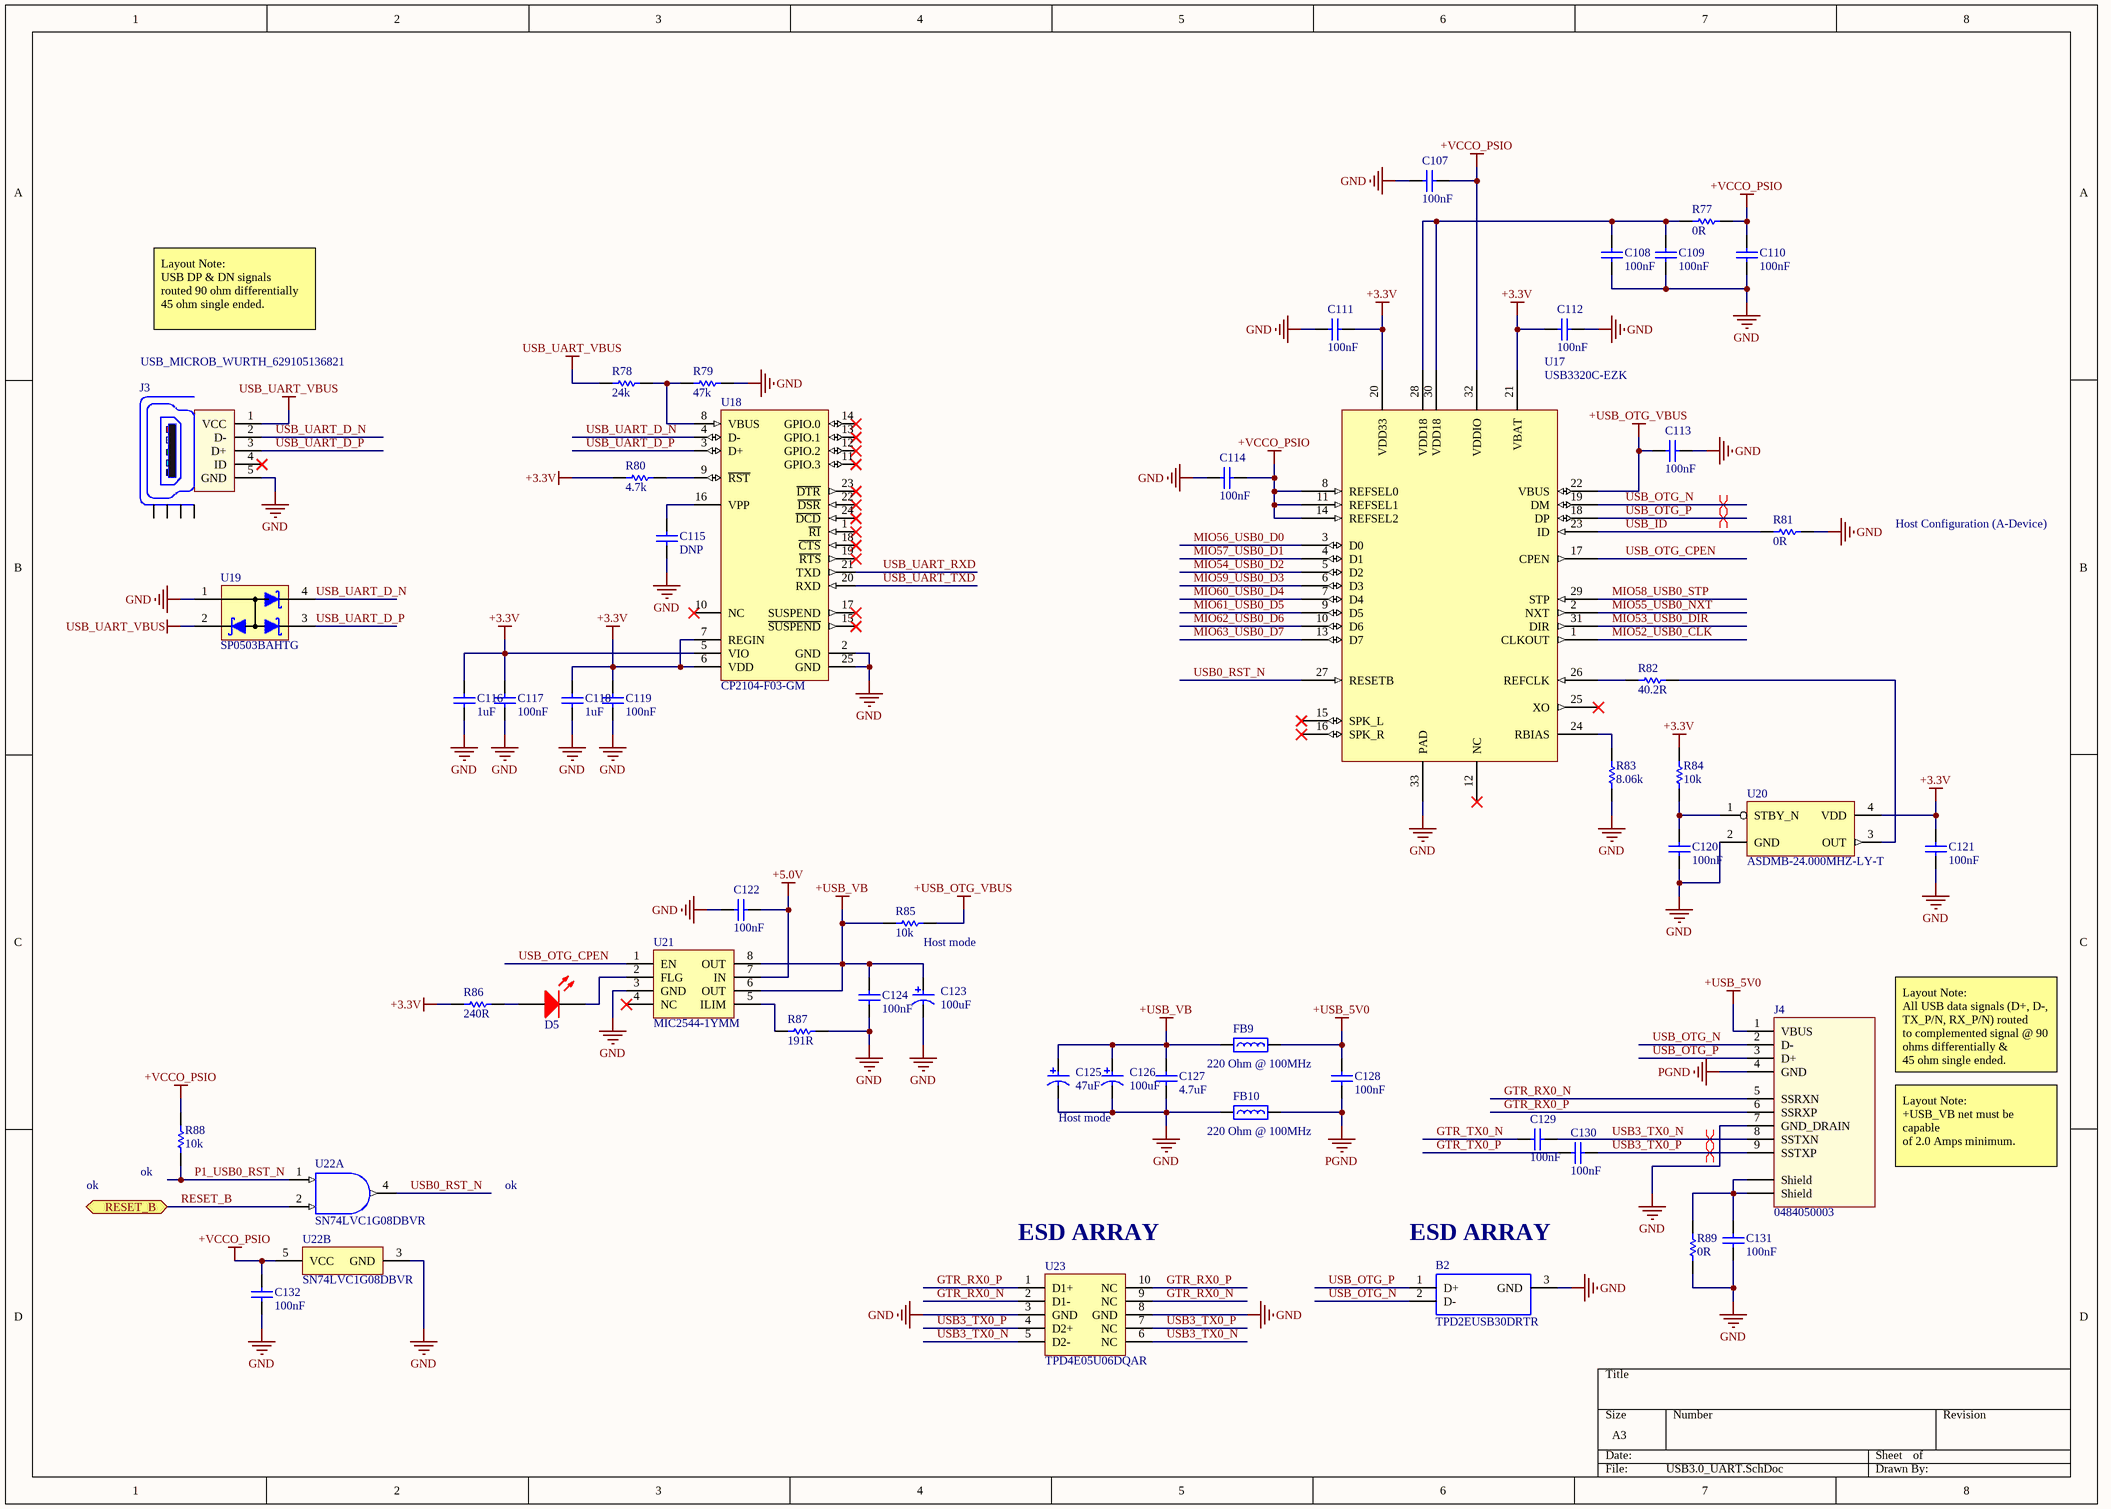
[diagram p17: USB3.0_UART.SchDoc]

### Parts
B2  TPD2EUSB30DRTR  [SOTFL35P100X50-3N]
C107  100nF  [CAPC1005L_0402]
C108  100nF  [CAPC1005L_0402]
C109  100nF  [CAPC1005L_0402]
C110  100nF  [CAPC1005L_0402]
C111  100nF  [CAPC1005L_0402]
C112  100nF  [CAPC1005L_0402]
C113  100nF  [CAPC1005L_0402]
C114  100nF  [CAPC1005L_0402]
C115  DNP  [CAPC1005L_0402]
C116  1uF  [CAPC1005L_0402]
C117  100nF  [CAPC1005L_0402]
C118  1uF  [CAPC1005L_0402]
C119  100nF  [CAPC1005L_0402]
C120  100nF  [CAPC1005L_0402]
C121  100nF  [CAPC1005L_0402]
C122  100nF  [CAPC1005L_0402]
C123  100uF  [AVX_TAN_F95_P_0905]
C124  100nF  [CAPC1005L_0402]
C125  47uF  [AVX_TAN_F38_M_0603]
C126  100uF  [AVX_TAN_F95_P_0905]
C127  4.7uF  [CAPC1005L_0402]
C128  100nF  [CAPC1005L_0402]
C129  100nF  [CAPC1005L_0402]
C130  100nF  [CAPC1005L_0402]
C131  100nF  [CAPC1005L_0402]
C132  100nF  [CAPC1005L_0402]
D5  LED0603RED  [LED0603RED]  (value not drawn)
FB9  Impedance @ Frequency: 220 Ohm @ 100MHz  [INDC1608N_0603]  (hidden comment: BEAD0603_220_2A5_40M)
FB10  Impedance @ Frequency: 220 Ohm @ 100MHz  [INDC1608N_0603]  (hidden comment: BEAD0603_220_2A5_40M)
J3  USB_MICROB_WURTH_629105136821  [USB_MICROB_WURTH_629105136821]
J4  0484050003  [USB30_RA_0484050003]
R77  value 0R  [RESC1005L_0402]  (hidden comment: RES0402_0R_0W1)
R78  value 24k  [RESC1005L_0402]  (hidden comment: RES0402_24K_0W1)
R79  value 47k  [RESC1005L_0402]  (hidden comment: RES0402_47K_0W1)
R80  value 4.7k  [RESC1005L_0402]  (hidden comment: RES0402_4K7_0W1_1T)
R81  value 0R  [RESC1005L_0402]  (hidden comment: RES0402_0R_0W1)
R82  value 40.2R  [RESC1005L_0402]  (hidden comment: RES0402_40R2_0W1_1T)
R83  value 8.06k  [RESC1005L_0402]  (hidden comment: RES0402_8K06_0W1_1T)
R84  value 10k  [RESC1005L_0402]  (hidden comment: RES0402_10K_0W1_05T)
R85  value 10k  [RESC1005L_0402]  (hidden comment: RES0402_10K_0W1_05T)
R86  value 240R  [RESC1005L_0402]  (hidden comment: RES0402_240R_0W1_1T)
R87  value 191R  [RESC1005L_0402]  (hidden comment: RES0402_191R_0W1_1T)
R88  value 10k  [RESC1005L_0402]  (hidden comment: RES0402_10K_0W1_05T)
R89  value 0R  [RESC1005L_0402]  (hidden comment: RES0402_0R_0W1)
U17  USB3320C-EZK  [QFN50P500X500X100_HS-33N]
U18  CP2104-F03-GM  [SLAB-QFN-24-2675x2675TP_L]
U19  SP0503BAHTG  [SP0503BAHT_SOT143]
U20  ASDMB-24.000MHZ-LY-T  [ASDMB]
U21  MIC2544-1YMM  [TPD4E05U06DQAR]
U22  SN74LVC1G08DBVR  [DBV0005A_N]  (parts A,B of 2)
U23  TPD4E05U06DQAR  [TPD4E05U06DQAR]

### Ports
RESET_B

### Nets
+3.3V: C111.2 C112.2 C116.1 C117.1 C118.1 C119.1 C121.1 R80.1 R84.1 R86.1 U17.20(VDD33) U17.21(VBAT) U18.5(VIO) U18.6(VDD) U18.7(REGIN) U20.4(VDD)
+5.0V: C122.2 U21.7(IN)
+USB_5V0: C128.1 FB9.2 J4.1(VBUS)
+USB_OTG_VBUS: C113.1 R85.2 U17.22(VBUS)
+USB_VB: C123.1 C124.1 C125.1 C126.1 C127.2 FB9.1 R85.1 U21.6(OUT) U21.8(OUT)
+VCCO_PSIO: C107.2 C110.2 C114.2 C132.1 R77.2 R88.2 U17.8(REFSEL0) U17.11(REFSEL1) U17.14(REFSEL2) U17.32(VDDIO) U22.5(VCC)  [project net +VCCAUX]
GND: B2.3(GND) C107.1 C108.2 C109.1 C110.1 C111.1 C112.1 C113.2 C114.1 C115.2 C116.2 C117.2 C118.2 C119.2 C120.2 C121.2 C122.1 C123.2 C124.2 C125.2 C126.2 C127.1 C131.2 C132.2 FB10.1 J3.5(GND) J4.7(GND_DRAIN) R79.2 R81.2 R83.2 R87.1 R89.1 U17.33(PAD) U18.2(GND) U18.25(GND) U19.1 U20.2(GND) U21.3(GND) U22.3(GND) U23.3(GND) U23.8(GND)
PGND: C128.2 FB10.2 J4.4(GND)
USB_UART_VBUS: J3.1(VCC) R78.1 U19.2
GTR_RX0_N: J4.5(SSRXN) U23.2(D1-) U23.9(NC)
GTR_RX0_P: J4.6(SSRXP) U23.1(D1+) U23.10(NC)
GTR_TX0_N: C129.1
GTR_TX0_P: C130.1
MIO52_USB0_CLK: U17.1(CLKOUT)
MIO53_USB0_DIR: U17.31(DIR)
MIO54_USB0_D2: U17.5(D2)
MIO55_USB0_NXT: U17.2(NXT)
MIO56_USB0_D0: U17.3(D0)
MIO57_USB0_D1: U17.4(D1)
MIO58_USB0_STP: U17.29(STP)
MIO59_USB0_D3: U17.6(D3)
MIO60_USB0_D4: U17.7(D4)
MIO61_USB0_D5: U17.9(D5)
MIO62_USB0_D6: U17.10(D6)
MIO63_USB0_D7: U17.13(D7)
P1_USB0_RST_N: R88.1 U22.1(A)
RESET_B: U22.2(B) ; port RESET_B
USB0_RST_N: U17.27(RESETB) U22.4(Y)
USB3_TX0_N: C129.2 J4.8(SSTXN) U23.5(D2-) U23.6(NC)
USB3_TX0_P: C130.2 J4.9(SSTXP) U23.4(D2+) U23.7(NC)
USB_ID: R81.1 U17.23(ID)
USB_OTG_CPEN: U17.17(CPEN) U21.1(EN)
USB_OTG_N: B2.2(D-) J4.2(D-) U17.19(DM)
USB_OTG_P: B2.1(D+) J4.3(D+) U17.18(DP)
USB_UART_D_N: J3.2(D-) U18.4(D-) U19.4
USB_UART_D_P: J3.3(D+) U18.3(D+) U19.3
USB_UART_RXD: U18.21(TXD)
USB_UART_TXD: U18.20(RXD)
NetC108_1: C108.1 C109.2 R77.1 U17.28(VDD18) U17.30(VDD18)
NetC115_1: C115.1 U18.16(VPP)
NetC120_1: C120.1 R84.2 U20.1(STBY_N)
NetC131_1: C131.1 J4.MH1(Shield) J4.MH2(Shield) R89.2
NetD5_1: D5.1(A) R86.2
NetD5_2: D5.2(K) U21.2(FLG)
NetR78_2: R78.2 R79.1 U18.8(VBUS)
NetR80_2: R80.2 U18.9(~{RST})
NetR82_1: R82.1 U17.26(REFCLK)
NetR82_2: R82.2 U20.3(OUT)
NetR83_1: R83.1 U17.24(RBIAS)
NetR87_2: R87.2 U21.5(ILIM)

Not connected (* = marked no-connect by the designer): J3 4(ID)* Z1(Shield) Z2(Shield) Z3(Shield) Z4(Shield); U17 12(NC)* 15(SPK_L)* 16(SPK_R)* 25(XO)*; U18 1(~{RI})* 10(NC)* 11(GPIO.3)* 12(GPIO.2)* 13(GPIO.1)* 14(GPIO.0)* 15(~{SUSPEND})* 17(SUSPEND)* 18(~{CTS})* 19(~{RTS})* 22(~{DSR})* 23(~{DTR})* 24(~{DCD})*; U21 4(NC)*

### Layout directives
differential pair: USB3_TX0_N, USB3_TX0_P, USB_OTG_N, USB_OTG_P

### Notes on the sheet
- Layout Note:
  USB DP & DN signals
  routed 90 ohm differentially
  45 ohm single ended.
- Host Configuration (A-Device)
- (near R85) Host mode
- Host mode
- Layout Note:
  All USB data signals (D+, D-,
  TX_P/N, RX_P/N) routed
  to complemented signal @ 90
  ohms differentially &
  45 ohm single ended.
- ok
- (near R88) ok
- Layout Note:
  +USB_VB net must be capable
  of 2.0 Amps minimum.
- (near U23) ESD ARRAY
- (near B2) ESD ARRAY

### Library data of the parts
B2 = D TPD2EUSB30DRTR: Texas Instruments TPD2EUSB30DRTR Dual Bi-Directional TVS Diode Array, 45W peak, 3-Pin SOT; Geometry.Height: 0.5mm; Unidirectional Channels: 2; Voltage - Reverse Standoff (Typ): 5.5V (Max); Voltage - Breakdown (Min): 7V; Voltage - Clamping (Max) @ Ipp: 8V; Current - Peak Pulse (10/1000µs): 1A (8/20µs); Power Line Protection: Yes; Manufacturer_Name: Texas Instruments; Manufacturer_Part_Number: TPD2EUSB30DRTR; Datasheet Link: http://docs-europe.electrocomponents.com/webdocs/1520/0900766b81520865.pdf; Digi-Key Part Number: 296-25509-1-ND; Type: Steering; Power - Peak Pulse: 45W; Operating Temperature: -40°C ~ 85°C (TA); Mounting Type: Surface Mount; Package / Case: SOT-3; Supplier Device Package: SOT-3; Supplier 1: Digi-Key; Supplier Part Number 1: 296-25509-6-ND
C107-C114 C117 C119-C122 C124 C128-C132 = CAPCER0402X7R100N25V_10T: as C426-C429 on sheet PS_GTR; Package: 0402; ComponentLink1Description: Datasheet; Value: 100nF; Voltage: 25V; Temperature Coefficient: X7R; Supplier 1: Digi-Key; Supplier Part Number 1: 490-10698-1-ND; Operating Temperature: -55°C ~ 125°C
C115 = CAPCER0402: 0402 Package Cap Footprint; Package: 0402; ComponentLink1Description: Datasheet; Value: DNP
C116 C118 = CAPCER0402X5R1U16V_20T: as C439 on sheet PS_GTR; Package: 0402; ComponentLink1Description: Datasheet; Value: 1uF; Voltage: 16V; Temperature Coefficient: X5R; Supplier 1: Digi-Key; Supplier Part Number 1: 490-10454-1-ND; Operating Temperature: -55°C ~ 85°C
C123 C126 = CAPELE0905TAN100U6V3_20T: CAP TANT 100UF 6.3V 20% 0805; Manufacturer 1: AVX Corporation; Manufacturer Part Number 1: F950J107MPAAQ2; Temperature Coefficient: Tantalum; ESR: 1.2 Ohm; Package: 0905 P; ComponentLink1Description: Datasheet; ComponentLink1URL: C:\Users\Public\Documents\Altium\AD16\Library\PDF\F95.pdf; Value: 100uF; Voltage: 6.3V; Tolerance: 20%; Supplier 1: Digi-Key; Supplier Part Number 1: 478-8393-1-ND; Operating Temperature: -55°C ~ 125°C
C125 = CAPELE0603TAN47U6V3_20T: CAP TANT POLY 47UF 6.3V SMD; Manufacturer 1: AVX Corporation; Manufacturer Part Number 1: F380J476MMAAXE; Tolerance: 20%; Temperature Coefficient: Tantalum; ESR: 300 mOhm; Package: 0603 M; ComponentLink1Description: Datasheet; ComponentLink1URL: C:\Users\Public\Documents\Altium\AD16\Library\PDF\f38.pdf; Value: 47uF; Voltage: 6.3V; Supplier 1: Digi-Key; Supplier Part Number 1: 478-9399-1-ND; Operating Temperature: -55°C ~ 105°C
C127 = CAPCER0402X5R4U710V_10T: CAP CER 4.7UF 10V X5R 0402; Manufacturer 1: TDK Corporation; Manufacturer Part Number 1: C1005X5R1A475K050BC; Tolerance: 10%; Package: 0402; ComponentLink1Description: Datasheet; Value: 4.7uF; Voltage: 10V; Temperature Coefficient: x5R; Supplier 1: Digi-Key; Supplier Part Number 1: 445-13820-1-ND; Operating Temperature: -55°C ~ 85°C
D5 = LED0603RED: LED RED DIFFUSED 0603 SMD; Manufacturer 1: Broadcom Limited; Manufacturer Part Number 1: HSMH-C191; Voltage - Forward (Vf) (Typ): 1.8V; Current - Test: 20mA; Package: 0603; Supplier 1: Digi-Key; Supplier Part Number 1: 516-3067-1-ND; ComponentLink1Description: Datasheet; ComponentLink1URL: C:\Users\Public\Documents\Altium\AD16\Library\PDF\AV02-0592EN0.pdf
FB9 FB10 = BEAD0603_220_2A5_40M: as FB42 on sheet PS_GTR; Package: 0603; ComponentLink1Description: Datasheet; ComponentLink1URL: C:\Users\Public\Documents\Altium\AD16\Library\PDF\ENFA0003.pdf; Supplier 1: Digi-Key; Supplier Part Number 1: 490-5225-1-ND; Operating Temperature: -55°C ~ 125°C
J3 = USB_MICROB_WURTH_629105136821: CONN RCPT USB MICRO B R/A SMT; Manufacturer 1: Wurth Electronics Inc; Number of Contacts: 5; Opearating Temperature: -40°C ~ 105°C; ComponentLink1Description: Datasheet; ComponentLink1URL: C:\Users\Public\Documents\Altium\AD16\Library\PDF\629105136821.pdf; Supplier 1: Digi-Key; Manufacturer Part Number 1: 629105136821; Supplier Part Number 1: 732-3155-1-ND
J4 = 0484050003: USB 3.0 RA REC TH TYPE A; Manufacturer 1: Molex, LLC; Number of Contacts: 9; Opearating Temperature: -20°C ~ 85°C; ComponentLink1Description: Datasheet; ComponentLink1URL: C:\Users\Public\Documents\Altium\AD16\Library\PDF\484050003_sd.pdf; Supplier 1: Digi-Key; Manufacturer Part Number 1: 0484050003; Supplier Part Number 1: WM10419-ND
R77 R81 R89 = RES0402_0R_0W1: as R305 on sheet PS_GTR; Package: 0402; ComponentLink1Description: Datasheet; Power: 1/10W; Tolerance: -; Supplier 1: Digi-Key; Supplier Part Number 1: P0.0JCT-ND
R78 = RES0402_24K_0W1: RES SMD 24K OHM 1% 1/10W 0402; Manufacturer 1: Panasonic Electronic Components; Manufacturer Part Number 1: ERJ-2RKF2402X; Package: 0402; ComponentLink1Description: Datasheet; Power: 1/10W; Tolerance: 1%; Supplier 1: Digi-Key; Supplier Part Number 1: P24.0KLCT-ND
R79 = RES0402_47K_0W1: RES SMD 47K OHM 1% 1/10W 0402; Manufacturer 1: Panasonic Electronic Components; Manufacturer Part Number 1: ERJ-2RKF4702X; Package: 0402; ComponentLink1Description: Datasheet; Power: 1/10W; Tolerance: 1%; Supplier 1: Digi-Key; Supplier Part Number 1: P47.0KLCT-ND
R80 = RES0402_4K7_0W1_1T: RES SMD 4.7K OHM 1% 1/10W 0402; Manufacturer 1: Panasonic Electronic Components; Manufacturer Part Number 1: ERJ-2RKF4701X; Package: 0402; ComponentLink1Description: Datasheet; Power: 1/10W; Tolerance: 1%; Supplier 1: Digi-Key; Supplier Part Number 1: P4.70KLCT-ND
R82 = RES0402_40R2_0W1_1T: RES SMD 40.2 OHM 1% 1/10W 0402; Manufacturer 1: Panasonic Electronic Components; Manufacturer Part Number 1: ERJ-2RKF40R2X; Package: 0402; ComponentLink1Description: Datasheet; Power: 1/10W; Tolerance: 1%; Supplier 1: Digi-Key; Supplier Part Number 1: P40.2LCT-ND
R83 = RES0402_8K06_0W1_1T: RES SMD 8.06K OHM 1% 1/10W 0402; Manufacturer 1: Panasonic Electronic Components; Manufacturer Part Number 1: ERJ-2RKF8061X; Package: 0402; ComponentLink1Description: Datasheet; Power: 1/10W; Tolerance: 1%; Supplier 1: Digi-Key; Supplier Part Number 1: P8.06KLCT-ND
R84 R85 R88 = RES0402_10K_0W1_05T: as R307 on sheet PS_GTR; Package: 0402; ComponentLink1Description: Datasheet; Power: 1/16W; Tolerance: 0.5%; Supplier 1: Digi-Key; Supplier Part Number 1: P15984CT-ND
R86 = RES0402_240R_0W1_1T: as R196 on sheet DisplayPort; Package: 0402; ComponentLink1Description: Datasheet; Power: 1/10W; Tolerance: 1%; Supplier 1: Digi-Key; Supplier Part Number 1: P240LCT-ND
R87 = RES0402_191R_0W1_1T: RES SMD 191 OHM 1% 1/10W 0402; Manufacturer 1: Panasonic Electronic Components; Manufacturer Part Number 1: ERJ-2RKF1910X; Package: 0402; ComponentLink1Description: Datasheet; Power: 1/10W; Tolerance: 1%; Supplier 1: Digi-Key; Supplier Part Number 1: P191LCT-ND
U17 = USB3320C-EZK: IC TXRX USB 2.0 FLEXPWR 32QFN; Manufacturer 1: Microchip Technology; ComponentLink1Description: Datasheet; ComponentLink1URL: C:\Users\Public\Documents\Altium\AD16\Library\PDF\00001792E.pdf; Supplier 1: Digi-Key; Supplier Part Number 1: USB3320C-EZK-ND; Manufacturer Part Number 1: USB3320C-EZK; Operating Temperature: -40°C ~ 85°C
U18 = CP2104-F03-GM: Single-Chip USB to UART Bridge, 4 Dig I/O Pins, Internal Oscillator, 1024 Bytes EEPROM, -40 to 85 degC, 24-pin QFN; Manufacturer 1: Silicon Labs; Internal Oscillator: TRUE; Sub-Family: USB Bridges; DatasheetVersion: Rev. 1.0; PackageReference: QFN-24; PackageDescription: 24-Pin Quad-Flat No-Leads Package, Body 4 x 4 mm, Pitch 0.5 mm; Supplier 1: Digi-Key; Supplier Part Number 1: 336-2008-5-ND; Supplier 2: Mouser; Supplier Part Number 2: 634-CP2104-F03-GM; EEPROM: 1024 Bytes; Mounting Technology: Surface Mount; Code_JEDEC: MO-220; Code_IPC: J-STD-020; Manufacturer Part Number 1: CP2104-F03-GM; ComponentLink1Description: Manufacturer URL; ComponentLink1URL: http://www.silabs.com/; ComponentLink2Description: Datasheet; ComponentLink2URL: C:\Users\Public\Documents\Altium\AD16\Library\PDF\cp2104.pdf; ComponentLink3Description: Package Specification; ComponentLink3URL: http://www.silabs.com/Support%20Documents/TechnicalDocs/C8051F93x-92x.pdf; Operating Temperature: -40°C ~ 85°C
U19 = SP0503BAHTG: IC TXRX USB 2.0 FLEXPWR 32QFN; Manufacturer 1: Littelfuse Inc.; ComponentLink1Description: Datasheet; ComponentLink1URL: C:\Users\Public\Documents\Altium\AD16\Library\PDF\SP05xxBA.pdf; Supplier 1: Digi-Key; Supplier Part Number 1: F2715CT-ND; Manufacturer Part Number 1: SP0503BAHTG; Operating Temperature: -40°C ~ 85°C (TA)
U20 = ASDMB-24.000MHZ-LY-T: OSC MEMS 24.000MHZ CMOS SMD; Manufacturer 1: Abracon LLC; Frequency: 24MHz; Frequency Stability: ±10ppm; ComponentLink1Description: Datasheet; ComponentLink1URL: C:\Users\Public\Documents\Altium\AD16\Library\PDF\ASDMB.pdf; Supplier 1: Digi-Key; Supplier Part Number 1: 535-11186-1-ND; Manufacturer Part Number 1: ASDMB-24.000MHZ-LY-T; Operating Temperature: -40°C ~ 85°C
U21 = MIC2544-1YMM: IC SW CURR LIMIT HI SIDE 8-MSOP; Manufacturer 1: Microchip Technology; Manufacturer Part Number 1: MIC2544-1YMM-TR; ComponentLink1Description: Datasheet; ComponentLink1URL: C:\Users\Public\Documents\Altium\AD16\Library\PDF\20005725B.pdf; Supplier 1: Digi-Key; Supplier Part Number 1: MIC2544-1YMM-CT-ND; Operating Temperature: -40 to +85 Celcius
U22 = SN74LVC1G08DBVR: Single 2-Input Positive-AND Gate, DBV0005A, LARGE T&R; Manufacturer 1: Texas Instruments; VCC(Min)(V): 1.65; VCC(Max)(V): 5.5; Output Type: CMOS; ICC @ Nom Voltage(Max)(mA): 0.01; Input Type: CMOS/TTL; Bits(#): 1; F @ Nom Voltage(Max)(Mhz): 150; Rating: Catalog; Technology Family: LVC; Voltage(Nom)(V): 1.8,2.5,3.3,5; Schmitt Trigger: No; Output Drive (IOL/IOH)(Max)(mA): 32/-32; tpd @ Nom Voltage(Max)(ns): 4.5,6,4,5; Logic: True; Gate Type: AND; DatasheetVersion: SCES217Y; PackageReference: DBV0005A; Supplier 2: Mouser; Supplier Part Number 2: 595-SN74LVC1G08DBVR; Supplier 1: Digi-Key; Supplier Part Number 1: 296-11601-2-ND; Supplier 3: Digi-Key; Supplier Part Number 3: 296-11601-1-ND; Supplier 4: Digi-Key; Supplier Part Number 4: 296-11601-6-ND; Generic Part Number: SN74LVC1G08; Operating Temperature: -40°C ~ 125°C; Sub-Family: AND Gate; 3-State Output: No; Manufacturer Part Number 1: SN74LVC1G08DBVR; ComponentLink1Description: Manufacturer URL; ComponentLink1URL: C:\Users\Public\Documents\Altium\AD16\Library\PDF\sn74lvc1g08.pdf
U23 = TPD4E05U06DQAR: TVS DIODE 5.5VWM 14VC 10SON; Manufacturer 1: Texas Instruments; ComponentLink1Description: Datasheet; ComponentLink1URL: C:\Users\Public\Documents\Altium\AD16\Library\PDF\tpd4e05u06.pdf; Supplier 1: Digi-Key; Supplier Part Number 1: 296-35765-1-ND; Manufacturer Part Number 1: TPD4E05U06DQAR; Operating Temperature: -40°C ~ 125°C (TA)